# Altium schematic sheet POWER.SchDoc
size A4
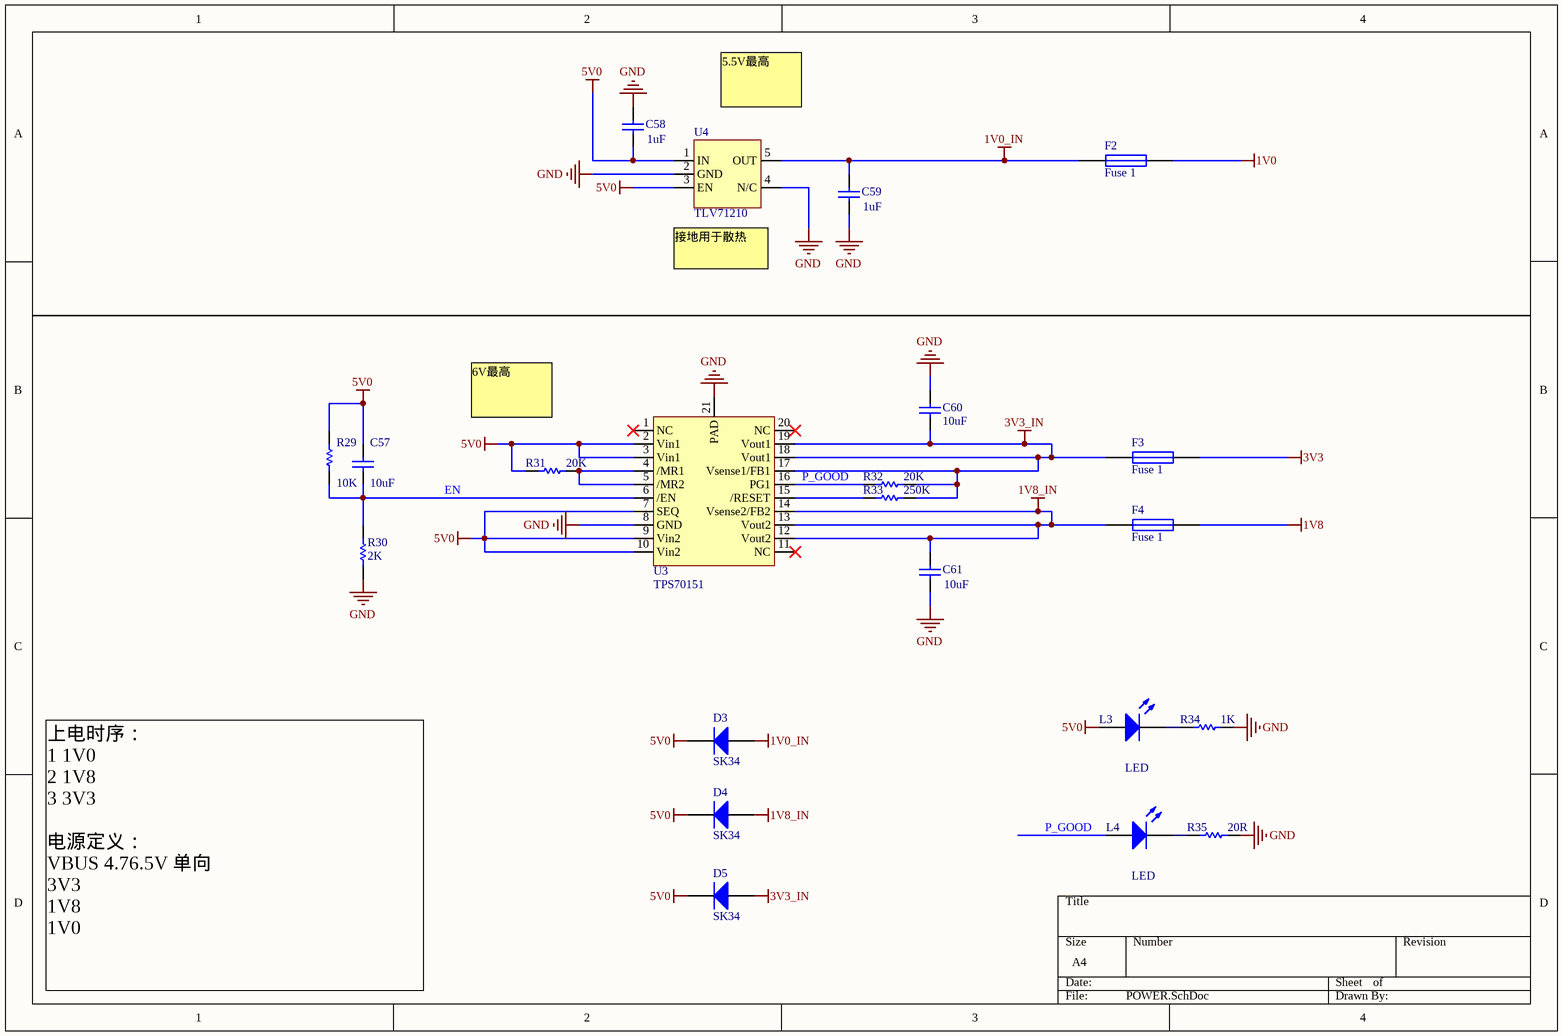
[diagram p0: POWER.SchDoc]

## Parts
C57  value 10uF  [1608[0603]]  (hidden comment: Cap)
C58  value 1uF  [1608[0603]]  (hidden comment: Cap)
C59  value 1uF  [1608[0603]]  (hidden comment: Cap)
C60  value 10uF  [1608[0603]]  (hidden comment: Cap)
C61  value 10uF  [1608[0603]]  (hidden comment: Cap)
D3  SK34  [1206]
D4  SK34  [1206]
D5  SK34  [1206]
F2  Fuse 1  [1206]
F3  Fuse 1  [1206]
F4  Fuse 1  [1206]
L3  LED  [1608[0603]]
L4  LED  [1608[0603]]
R29  value 10K  [1608[0603]]  (hidden comment: Res)
R30  value 2K  [1608[0603]]  (hidden comment: Res)
R31  value 20K  [1608[0603]]  (hidden comment: Res)
R32  value 20K  [1608[0603]]  (hidden comment: Res)
R33  value 250K  [1608[0603]]  (hidden comment: Res)
R34  value 1K  [1608[0603]]  (hidden comment: Res)
R35  value 20R  [1608[0603]]  (hidden comment: Res)
U3  TPS70151  [TPS701]
U4  TLV71210  [TLV712]

## Nets
1V0: F2.1
1V0_IN: C59.1 D3.1(A) F2.2 U4.5(OUT)
1V8: F4.1
1V8_IN: C61.1 D4.1(A) F4.2 U3.12(Vout2) U3.13(Vout2) U3.14(Vsense2/FB2)
3V3: F3.1
3V3_IN: C60.1 D5.1(A) F3.2 R32.1 R33.1 U3.17(Vsense1/FB1) U3.18(Vout1) U3.19(Vout1)
5V0: C57.1 C58.2 D3.2(K) D4.2(K) D5.2(K) L3.1(A) R29.1 R31.2 U3.2(Vin1) U3.3(Vin1) U3.7(SEQ) U3.9(Vin2) U3.10(Vin2) U4.1(IN) U4.3(EN)
GND: C58.1 C59.2 C60.2 C61.2 R30.2 R34.1 R35.1 U3.8(GND) U3.21(PAD) U4.2(GND) U4.4(N/C)
EN: C57.2 R29.2 R30.1 U3.6(/EN)
P_GOOD: L4.1(A) R32.2 U3.16(PG1)
NetL3_2: L3.2(K) R34.2
NetL4_2: L4.2(K) R35.2
NetR31_1: R31.1 U3.4(/MR1) U3.5(/MR2)
NetR33_2: R33.2 U3.15(/RESET)

Not connected (* = marked no-connect by the designer): U3 1(NC)* 11(NC)* 20(NC)*

## Notes on the sheet
- 5.5V最高
- (near U4) 接地用于散热
- 6V最高
- 上电时序：
  1 1V0
  2 1V8
  3 3V3
  电源定义：
  VBUS 4.76.5V 单向
  3V3
  1V8
  1V0

## Library data of the parts
C57-C61 = Cap: 贴片电容; Published: 8-Jun-2000; LatestRevisionDate: 17-Jul-2002; LatestRevisionNote: Re-released for DXP Platform.; PackageReference: RAD-0.3; Publisher: Altium Limited
D3-D5 = Diode 1N4148: High Conductance Fast Diode; LatestRevisionDate: 17-Jul-2002; LatestRevisionNote: Re-released for DXP Platform.; DatasheetDocument: 1997; PackageReference: DO-35; Publisher: Altium Limited; Code_JEDEC: DO-204-AH; ComponentLink1Description: Manufacturer Link; ComponentLink2Description: Datasheet; ComponentLink2URL: http://www.fairchildsemi.com/ds/1N%2F1N4148.pdf
F2-F4 = Fuse 1: Fuse; Published: 8-Jun-2000; LatestRevisionDate: 17-Jul-2002; LatestRevisionNote: Re-released for DXP Platform.; PackageReference: PIN-W2/E2.8; Publisher: Altium Limited; PackageDescription: Thru-Hole; 2 Leads
R29-R35 = Res: 贴片电阻; Published: 8-Jun-2000; LatestRevisionDate: 17-Jul-2002; LatestRevisionNote: Re-released for DXP Platform.; PackageReference: AXIAL-0.3; Publisher: Altium Limited
U3 = TPS701
U4 = TLV712